# Altium schematic sheet MCU.SCHDOC
size B; Organization: Altium Limited; Address1: L3, 12a Rodborough Rd; Address2: Frenchs Forest; Address3: NSW; Address4: Australia 2086; DocumentNumber: 1; SheetNumber: 1; SheetTotal: 1
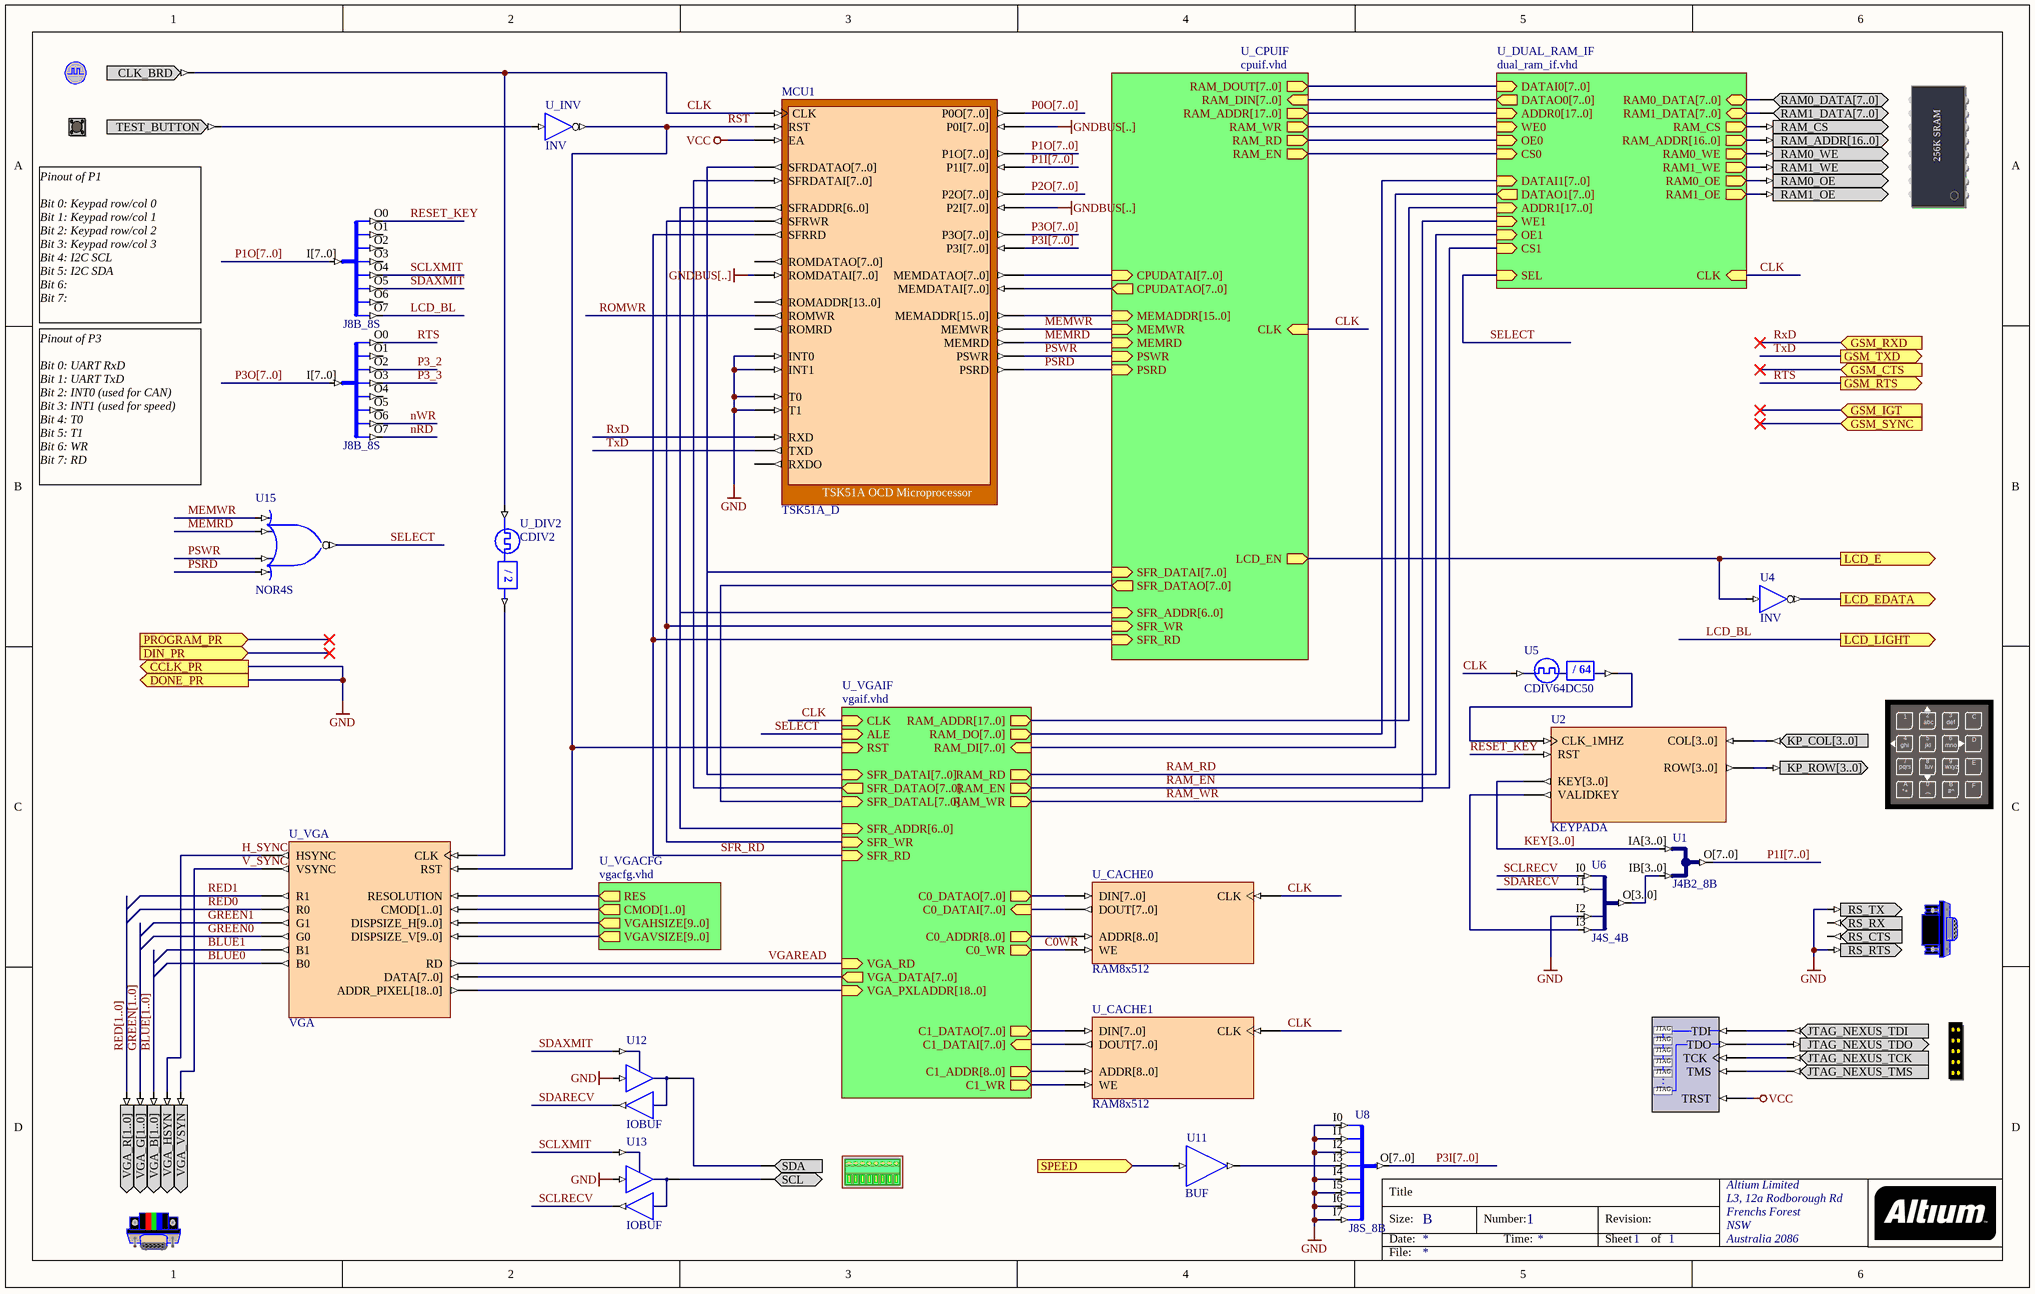
[diagram p0: MCU.SCHDOC]

## Parts
(Parts that share a designator on the sheet are numbered #1, #2 ... from top to bottom, then left to right.)
?#1  KEYPAD  (value not drawn)
?#2  RS232CNTR  (value not drawn)
?#3  NEXUS_JTAG_CONNECTOR  (value not drawn)
?#4  ADCDAC_I2C  (value not drawn)
MCU1  TSK51A_D
NEXUS_JTAG_PORT  NEXUS_JTAG_PORT  (value not drawn)
SRAM256kx8B  MEMORY256KX8  (value not drawn)
U1  J4B2_8B
U2  KEYPADA
U4  INV
U5  CDIV64DC50
U6  J4S_4B
U7  J8B_8S
U8  J8S_8B
U11  BUF
U12  IOBUF
U13  IOBUF
U15  NOR4S
U18  J8B_8S
U_CACHE0  RAM8x512
U_CACHE1  RAM8x512
U_CLKEXT  CLOCK_BOARD  (value not drawn)
U_DIV2  CDIV2
U_INV  INV
U_RSTEXT  TEST_BUTTON  (value not drawn)
U_VGA  VGA
U_VGAEXT  VGACNTR  (value not drawn)

## Sub-sheets
U_CPUIF = cpuif.vhd: MEMWR (in), RAM_EN (out), RAM_WR (out), RAM_RD (out), RAM_DOUT[7..0] (out), MEMRD (in), LCD_EN (out), RAM_ADDR[17..0] (out), CLK (in), SFR_ADDR[6..0] (in), SFR_DATAI[7..0] (in), SFR_DATAO[7..0] (out), SFR_WR (in), SFR_RD (in), RAM_DIN[7..0] (in), PSWR (in), PSRD (in), MEMADDR[15..0] (in), CPUDATAI[7..0] (in), CPUDATAO[7..0] (out)
U_DUAL_RAM_IF = dual_ram_if.vhd: DATAI0[7..0] (in), DATAI1[7..0] (in), DATAO0[7..0] (out), DATAO1[7..0] (out), ADDR0[17..0] (in), ADDR1[17..0] (in), WE0 (in), WE1 (in), OE0 (in), OE1 (in), CS0 (in), CS1 (in), SEL (in), RAM0_DATA[7..0] (bidir), RAM1_DATA[7..0] (bidir), RAM_ADDR[16..0] (out), RAM0_WE (out), RAM1_WE (out), RAM0_OE (out), RAM1_OE (out), RAM_CS (out), CLK (in)
U_VGACFG = vgacfg.vhd: RES (out), CMOD[1..0] (out), VGAHSIZE[9..0] (out), VGAVSIZE[9..0] (out)
U_VGAIF = vgaif.vhd: VGA_PXLADDR[18..0] (in), VGA_DATA[7..0] (out), VGA_RD (in), C1_WR (out), C1_ADDR[8..0] (out), C1_DATAI[7..0] (in), C1_DATAO[7..0] (out), C0_WR (out), C0_ADDR[8..0] (out), C0_DATAI[7..0] (in), C0_DATAO[7..0] (out), RAM_ADDR[17..0] (out), CLK (in), ALE (in), RAM_DO[7..0] (out), RAM_RD (out), RAM_EN (out), RAM_WR (out), SFR_ADDR[6..0] (in), SFR_DATAI[7..0] (in), SFR_DATAO[7..0] (out), SFR_WR (in), SFR_RD (in), SFR_DATAL[7..0] (in), RAM_DI[7..0] (in), RST (in)

## Ports
CCLK_PR (out), DIN_PR (in), DONE_PR (out), GSM_CTS (in), GSM_IGT (in), GSM_RTS (out), GSM_RXD (in), GSM_SYNC (in), GSM_TXD (out), LCD_E (out), LCD_EDATA (out), LCD_LIGHT (out), PROGRAM_PR (in), SPEED (in)

## Nets
GND: ?#2.RS_RTS ?#2.RS_TX MCU1.INT0 MCU1.INT1 MCU1.T0 MCU1.T1 U6.I2 U8.I0 U8.I1 U8.I2 U8.I4 U8.I5 U8.I6 U8.I7 U12.I U13.I ; port CCLK_PR, port DONE_PR
GNDBUS[..]: MCU1.P0I[7..0] MCU1.P2I[7..0] MCU1.ROMDATAI[7..0]
VCC: MCU1.EA NEXUS_JTAG_PORT.TRST
BLUE0: U_VGA.B0
BLUE1: U_VGA.B1
BLUE[1..0]: U_VGAEXT.VGA_B[1..0]
C0WR: U_CACHE0.WE ; sheet U_VGAIF/C0_WR
CLK: MCU1.CLK U5.CLKIN U_CACHE0.CLK U_CACHE1.CLK U_CLKEXT.CLK_BRD U_DIV2.CLKIN ; sheet U_CPUIF/CLK, sheet U_VGAIF/CLK, sheet U_DUAL_RAM_IF/CLK
GREEN0: U_VGA.G0
GREEN1: U_VGA.G1
GREEN[1..0]: U_VGAEXT.VGA_G[1..0]
H_SYNC: U_VGA.HSYNC U_VGAEXT.VGA_HSYN
KEY[3..0]: U1.IA[3..0] U2.KEY[3..0]
LCD_BL: U18.O7 ; port LCD_LIGHT
LCD_E: U4.I ; port LCD_E, sheet U_CPUIF/LCD_EN
LCD_EDATA: U4.O ; port LCD_EDATA
MEMRD: MCU1.MEMRD U15.I1 ; sheet U_CPUIF/MEMRD
MEMWR: MCU1.MEMWR U15.I0 ; sheet U_CPUIF/MEMWR
nRD: U7.O7
nWR: U7.O6
P0O[7..0]: MCU1.P0O[7..0]
P1I[7..0]: MCU1.P1I[7..0] U1.O[7..0]
P1O[7..0]: MCU1.P1O[7..0] U18.I[7..0]
P2O[7..0]: MCU1.P2O[7..0]
P3_2: U7.O2
P3_3: U7.O3
P3I[7..0]: MCU1.P3I[7..0] U8.O[7..0]
P3O[7..0]: MCU1.P3O[7..0] U7.I[7..0]
PSRD: MCU1.PSRD U15.I3 ; sheet U_CPUIF/PSRD
PSWR: MCU1.PSWR U15.I2 ; sheet U_CPUIF/PSWR
RAM_EN: sheet U_VGAIF/RAM_EN, sheet U_DUAL_RAM_IF/CS1
RAM_RD: sheet U_VGAIF/RAM_RD, sheet U_DUAL_RAM_IF/OE1
RAM_WR: sheet U_VGAIF/RAM_WR, sheet U_DUAL_RAM_IF/WE1
RED0: U_VGA.R0
RED1: U_VGA.R1
RED[1..0]: U_VGAEXT.VGA_R[1..0]
RESET_KEY: U2.RST U18.O0
ROMWR: MCU1.ROMWR
RST: MCU1.RST U_INV.O U_VGA.RST ; sheet U_VGAIF/RST
RTS: U7.O0 ; port GSM_RTS
RxD: MCU1.RXD ; port GSM_RXD
SCLRECV: U6.I0 U13.O
SCLXMIT: U13.T U18.O4
SDARECV: U6.I1 U12.O
SDAXMIT: U12.T U18.O5
SELECT: U15.O ; sheet U_VGAIF/ALE, sheet U_DUAL_RAM_IF/SEL
SFR_RD: MCU1.SFRRD ; sheet U_CPUIF/SFR_RD, sheet U_VGAIF/SFR_RD
SPEED: U11.I ; port SPEED
TxD: MCU1.TXD ; port GSM_TXD
V_SYNC: U_VGA.VSYNC U_VGAEXT.VGA_VSYN
VGAREAD: U_VGA.RD ; sheet U_VGAIF/VGA_RD
Net?#1_KP_COL[3..0]: ?#1.KP_COL[3..0] U2.COL[3..0]
Net?#1_KP_ROW[3..0]: ?#1.KP_ROW[3..0] U2.ROW[3..0]
Net?#3_JTAG_NEXUS_TCK: ?#3.JTAG_NEXUS_TCK NEXUS_JTAG_PORT.TCK
Net?#3_JTAG_NEXUS_TDI: ?#3.JTAG_NEXUS_TDI NEXUS_JTAG_PORT.TDI
Net?#3_JTAG_NEXUS_TDO: ?#3.JTAG_NEXUS_TDO NEXUS_JTAG_PORT.TDO
Net?#3_JTAG_NEXUS_TMS: ?#3.JTAG_NEXUS_TMS NEXUS_JTAG_PORT.TMS
Net?#4_SCL: ?#4.SCL U13.IO
Net?#4_SDA: ?#4.SDA U12.IO
NetMCU1_MEMADDR[15..0]: MCU1.MEMADDR[15..0] ; sheet U_CPUIF/MEMADDR[15..0]
NetMCU1_MEMDATAI[7..0]: MCU1.MEMDATAI[7..0] ; sheet U_CPUIF/CPUDATAO[7..0]
NetMCU1_MEMDATAO[7..0]: MCU1.MEMDATAO[7..0] ; sheet U_CPUIF/CPUDATAI[7..0]
NetMCU1_SFRADDR[6..0]: MCU1.SFRADDR[6..0] ; sheet U_CPUIF/SFR_ADDR[6..0], sheet U_VGAIF/SFR_ADDR[6..0]
NetMCU1_SFRDATAI[7..0]: MCU1.SFRDATAI[7..0] ; sheet U_VGAIF/SFR_DATAO[7..0]
NetMCU1_SFRDATAO[7..0]: MCU1.SFRDATAO[7..0] ; sheet U_CPUIF/SFR_DATAI[7..0], sheet U_VGAIF/SFR_DATAI[7..0]
NetMCU1_SFRWR: MCU1.SFRWR ; sheet U_CPUIF/SFR_WR, sheet U_VGAIF/SFR_WR
NetSRAM256kx8B_RAM0_DATA[7..0]: SRAM256kx8B.RAM0_DATA[7..0] ; sheet U_DUAL_RAM_IF/RAM0_DATA[7..0]
NetSRAM256kx8B_RAM0_OE: SRAM256kx8B.RAM0_OE ; sheet U_DUAL_RAM_IF/RAM0_OE
NetSRAM256kx8B_RAM0_WE: SRAM256kx8B.RAM0_WE ; sheet U_DUAL_RAM_IF/RAM0_WE
NetSRAM256kx8B_RAM1_DATA[7..0]: SRAM256kx8B.RAM1_DATA[7..0] ; sheet U_DUAL_RAM_IF/RAM1_DATA[7..0]
NetSRAM256kx8B_RAM1_OE: SRAM256kx8B.RAM1_OE ; sheet U_DUAL_RAM_IF/RAM1_OE
NetSRAM256kx8B_RAM1_WE: SRAM256kx8B.RAM1_WE ; sheet U_DUAL_RAM_IF/RAM1_WE
NetSRAM256kx8B_RAM_ADDR[16..0]: SRAM256kx8B.RAM_ADDR[16..0] ; sheet U_DUAL_RAM_IF/RAM_ADDR[16..0]
NetSRAM256kx8B_RAM_CS: SRAM256kx8B.RAM_CS ; sheet U_DUAL_RAM_IF/RAM_CS
NetU1_IB[3..0]: U1.IB[3..0] U6.O[3..0]
NetU2_CLK_1MHZ: U2.CLK_1MHZ U5.CLKDV
NetU2_VALIDKEY: U2.VALIDKEY U6.I3
NetU8_I3: U8.I3 U11.O
NetU_CACHE0_ADDR[8..0]: U_CACHE0.ADDR[8..0] ; sheet U_VGAIF/C0_ADDR[8..0]
NetU_CACHE0_DIN[7..0]: U_CACHE0.DIN[7..0] ; sheet U_VGAIF/C0_DATAO[7..0]
NetU_CACHE0_DOUT[7..0]: U_CACHE0.DOUT[7..0] ; sheet U_VGAIF/C0_DATAI[7..0]
NetU_CACHE1_ADDR[8..0]: U_CACHE1.ADDR[8..0] ; sheet U_VGAIF/C1_ADDR[8..0]
NetU_CACHE1_DIN[7..0]: U_CACHE1.DIN[7..0] ; sheet U_VGAIF/C1_DATAO[7..0]
NetU_CACHE1_DOUT[7..0]: U_CACHE1.DOUT[7..0] ; sheet U_VGAIF/C1_DATAI[7..0]
NetU_CACHE1_WE: U_CACHE1.WE ; sheet U_VGAIF/C1_WR
NetU_DIV2_CLKDV: U_DIV2.CLKDV U_VGA.CLK
NetU_INV_I: U_INV.I U_RSTEXT.TEST_BUTTON
NetU_VGA_ADDR_PIXEL[18..0]: U_VGA.ADDR_PIXEL[18..0] ; sheet U_VGAIF/VGA_PXLADDR[18..0]
NetU_VGA_CMOD[1..0]: U_VGA.CMOD[1..0] ; sheet U_VGACFG/CMOD[1..0]
NetU_VGA_DATA[7..0]: U_VGA.DATA[7..0] ; sheet U_VGAIF/VGA_DATA[7..0]
NetU_VGA_DISPSIZE_H[9..0]: U_VGA.DISPSIZE_H[9..0] ; sheet U_VGACFG/VGAHSIZE[9..0]
NetU_VGA_DISPSIZE_V[9..0]: U_VGA.DISPSIZE_V[9..0] ; sheet U_VGACFG/VGAVSIZE[9..0]
NetU_VGA_RESOLUTION: U_VGA.RESOLUTION ; sheet U_VGACFG/RES
(unnamed): sheet U_CPUIF/RAM_EN, sheet U_DUAL_RAM_IF/CS0
(unnamed): sheet U_CPUIF/RAM_WR, sheet U_DUAL_RAM_IF/WE0
(unnamed): sheet U_CPUIF/RAM_RD, sheet U_DUAL_RAM_IF/OE0

Not connected (* = marked no-connect by the designer): ?#2 RS_CTS RS_RX; MCU1 ROMADDR[13..0] ROMDATAO[7..0] ROMRD RXDO; U7 O1 O4 O5; U18 O1 O2 O3 O6

## Buses and harness runs
bus BLUE[1..0]
bus GREEN[1..0]
bus KEY[3..0]
bus P0O[7..0]
bus P1I[7..0]
bus P1O[7..0]
bus P2O[7..0]
bus P3I[7..0]
bus P3O[7..0]
bus RED[1..0]
bus sheet U_CPUIF/RAM_ADDR[17..0] = sheet U_DUAL_RAM_IF/ADDR0[17..0]
bus sheet U_CPUIF/RAM_DIN[7..0] = sheet U_DUAL_RAM_IF/DATAO0[7..0]
bus sheet U_CPUIF/RAM_DOUT[7..0] = sheet U_DUAL_RAM_IF/DATAI0[7..0]
bus sheet U_CPUIF/SFR_ADDR[6..0] = sheet U_VGAIF/SFR_ADDR[6..0]
bus sheet U_CPUIF/SFR_DATAI[7..0] = sheet U_VGAIF/SFR_DATAI[7..0]
bus sheet U_CPUIF/SFR_DATAO[7..0] = sheet U_VGAIF/SFR_DATAL[7..0]
bus sheet U_DUAL_RAM_IF/ADDR1[17..0] = sheet U_VGAIF/RAM_ADDR[17..0]
bus sheet U_DUAL_RAM_IF/DATAI1[7..0] = sheet U_VGAIF/RAM_DO[7..0]
bus sheet U_DUAL_RAM_IF/DATAO1[7..0] = sheet U_VGAIF/RAM_DI[7..0]

## Notes on the sheet
- (near U_RSTEXT) Pinout of P1
  Bit 0: Keypad row/col 0
  Bit 1: Keypad row/col 1
  Bit 2: Keypad row/col 2
  Bit 3: Keypad row/col 3
  Bit 4: I2C SCL
  Bit 5: I2C SDA
  Bit 6:
  Bit 7:
- Pinout of P3
  Bit 0: UART RxD
  Bit 1: UART TxD
  Bit 2: INT0 (used for CAN)
  Bit 3: INT1 (used for speed)
  Bit 4: T0
  Bit 5: T1
  Bit 6: WR
  Bit 7: RD
- Title
- Size:
- Date:
- B
- Number:
- Time:
- Revision:
- Sheet
- of
- File:
- (in symbol CDIV2) / 2
- (in symbol CDIV64DC50) / 64
- (in symbol KEYPAD) 1; 2; 3; C; abc; def; 4; 5; 6; ghi; jkl; mno; D; 7; 8; 9; E; pqrs; tuv; wxyz; A; 0; B; F; *+; (; #^
- (in symbol MEMORY256KX8) 256K SRAM
- (in symbol NEXUS_JTAG_PORT) JTAG; .

## Library data of the parts
?#1 = KEYPAD: Key Pad; PortComponent: True; Published: 19-Nov-2003; Publisher: Altium Limited
?#2 = RS232CNTR: DCE Serial Port Connector; PortComponent: True; Published: 19-Nov-2003; Publisher: Altium Limited
?#3 = NEXUS_JTAG_CONNECTOR: JTAG Port; PortComponent: True; Published: 19-Nov-2003; Publisher: Altium Limited
?#4 = ADCDAC_I2C: Analog Digital/ Digital Analog Converter, I2C Interface; PortComponent: True; Published: 19-Nov-2003; Publisher: Altium Limited
MCU1 = TSK51A_D: TSK51A OCD Microprocessor; NEXUS_CORE: Processor_OCDS; NEXUS_JTAG_DEVICE: True; NEXUS_JTAG_ORDER: 0; ChildModel1: RAM256x8_TSK51D; Published: 23/10/2003; Publisher: Altium Hobart Technology Centre; Core Revision: 1.00.00
NEXUS_JTAG_PORT = NEXUS_JTAG_PORT: Nexus Processor JTAG Chain Connector; NEXUS_JTAG_CONNECTOR: True; Published: 18-Nov-2003; Publisher: Altium Limited
SRAM256kx8B = MEMORY256KX8: SRAM 256kx8; PortComponent: True; Published: 19-Nov-2003; Publisher: Altium Limited
U1 = J4B2_8B: 2 x 4-Bit input bus to 1 x 8-bit output bus; Class I: Bus Joiner; ArchiveName: GENERIC; Published: 18-Sep-2003; Publisher: Altium Limited
U2 = KEYPADA: Keypad; Published: 2/01/2004; Publisher: Altium Hobart Technology Centre; Core Revision: 1.00.00
U4 U_INV = INV: Inverter; Class I: Logic Primitive; ArchiveName: GENERIC; Published: 18-Sep-2003; Publisher: Altium Limited; Xilinx Equivalent: INV
U5 = CDIV64DC50: Clock Divider by 64 with 50% Duty Cycle Output; ArchiveName: GENERIC; Published: 18-Dec-2003; Publisher: Altium Limited; Core Revision: 1.00.00
U6 = J4S_4B: 4 Single pin inputs to single 4-Bit output bus; Class I: Bus Joiner; ArchiveName: GENERIC; Published: 18-Sep-2003; Publisher: Altium Limited
U7 U18 = J8B_8S: 8-Bit input bus to 8 single pin outputs; Class I: Bus Joiner; ArchiveName: GENERIC; Published: 4-Jul-2003; Publisher: Altium Hobart Technology Centre
U8 = J8S_8B: 8 Single pin inputs to single 8-Bit output bus; Class I: Bus Joiner; ArchiveName: GENERIC; Published: 4-Jul-2003; Publisher: Altium Hobart Technology Centre
U11 = BUF: Buffer; ArchiveName: GENERIC; Published: 4-Jul-2003; Publisher: Altium Hobart Technology Centre; Class I: Buffer
U12 U13 = IOBUF: Input/Output Buffer; ArchiveName: GENERIC; Published: 9-30-2003; Publisher: Altium Limited; Xilinx Equivalent: IOBUF; Core Revision: 1.00.00
U15 = NOR4S: 4-Input NOR Gate, Single Pin Version; Xilinx Equivalent: NOR4; ArchiveName: GENERIC; Published: 9-30-2003; Publisher: Altium Limited; Core Revision: 1.00.00
U_CACHE0 U_CACHE1 = RAM8x512: Single Port Random Access Memory 512 x 8; Memory_Depth: 512; Memory_Type: RAM_SinglePortBlock; Memory_Width: 8; Memory_ClockEdge: Rising; Nexus_Core: Memory_Program; Published: 26/09/2003; Publisher: Altium Hobart Technology Center
U_CLKEXT = CLOCK_BOARD: Global System Clock Suply; PortComponent: True; Published: 19-Nov-2003; Publisher: Altium Limited
U_DIV2 = CDIV2: Clock Divider by 2; ArchiveName: GENERIC; Published: 4-Jul-2003; Publisher: Altium Hobart Technology Centre; Class I: Clock Divider
U_RSTEXT = TEST_BUTTON: Test Button; PortComponent: True; Published: 19-Nov-2003; Publisher: Altium Limited
U_VGA = VGA: VGA Controller; Published: 21/10/2003; Publisher: Altium Hobart Technology Centre; Core Revision: 1.00.00
U_VGAEXT = VGACNTR: VGA Dsub-15-Female-HD; PortComponent: True; Published: 19-Nov-2003; Publisher: Altium Limited